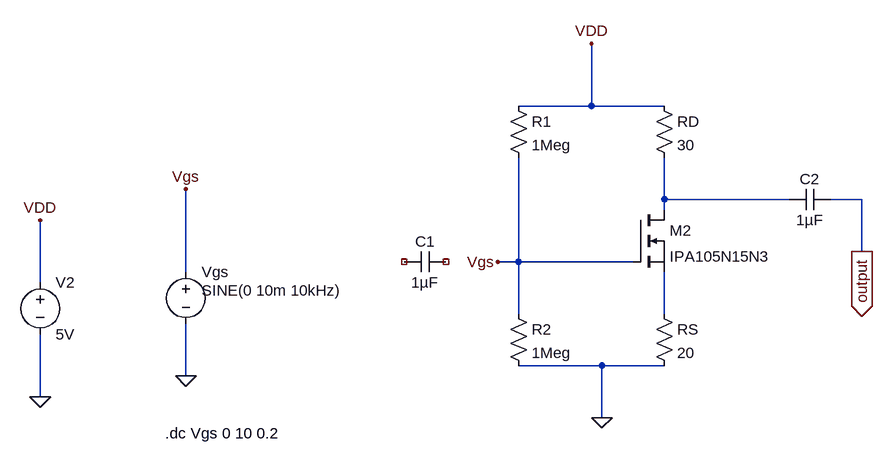
[diagram p0: schematic Draft7.asc]
Draft7.asc, the LTspice schematic file:
Version 4
SHEET 1 880 680
WIRE 128 -48 128 -144
WIRE 128 -48 16 -48
WIRE 240 -48 128 -48
WIRE 240 96 240 32
WIRE 432 96 240 96
WIRE 544 96 496 96
WIRE 240 112 240 96
WIRE 544 176 544 96
WIRE 16 192 16 32
WIRE 16 192 -16 192
WIRE 192 192 16 192
WIRE -496 208 -496 80
WIRE -720 224 -720 128
WIRE 16 272 16 192
WIRE 240 272 240 208
WIRE 144 352 16 352
WIRE 240 352 144 352
WIRE -496 368 -496 288
WIRE -720 400 -720 304
WIRE 144 432 144 352
FLAG 144 432 0
FLAG -496 368 0
FLAG 544 176 output
IOPIN 544 176 Out
FLAG -720 400 0
FLAG -720 128 VDD
FLAG 128 -144 VDD
FLAG -16 192 Vgs
FLAG -496 80 Vgs
SYMBOL res 0 256 R0
SYMATTR InstName R2
SYMATTR Value 1Meg
SYMBOL res 224 256 R0
SYMATTR InstName RS
SYMATTR Value 20
SYMBOL res 224 -64 R0
SYMATTR InstName RD
SYMATTR Value 30
SYMBOL res 0 -64 R0
SYMATTR InstName R1
SYMATTR Value 1Meg
SYMBOL voltage -496 192 R0
WINDOW 123 0 0 Left 0
WINDOW 39 0 0 Left 0
WINDOW 3 24 44 Left 2
SYMATTR Value SINE(0 10m 10kHz)
SYMATTR InstName Vgs
SYMBOL cap -96 176 R90
WINDOW 0 0 32 VBottom 2
WINDOW 3 32 32 VTop 2
SYMATTR InstName C1
SYMATTR Value 1µF
SYMBOL cap 496 80 R90
WINDOW 0 0 32 VBottom 2
WINDOW 3 32 32 VTop 2
SYMATTR InstName C2
SYMATTR Value 1µF
SYMBOL voltage -720 208 R0
WINDOW 123 0 0 Left 0
WINDOW 39 0 0 Left 0
SYMATTR InstName V2
SYMATTR Value 5V
SYMBOL nmos 192 112 R0
SYMATTR InstName M2
SYMATTR Value IPA105N15N3
TEXT -528 456 Left 2 !.dc Vgs 0 10 0.2

The netlist it stands for:
* Draft7.asc
R2 Vgs 0 1Meg
RS N002 0 20
RD VDD N001 30
R1 VDD Vgs 1Meg
Vgs Vgs 0 SINE(0 10m 10kHz)
C1 NC_01 NC_02 1µF
C2 output N001 1µF
V2 VDD 0 5V
M2 N001 Vgs N002 N002 IPA105N15N3
.model NMOS NMOS
.model PMOS PMOS
.lib standard.mos
.dc Vgs 0 10 0.2
.backanno
.end

* Results of the author's LTspice run, read from the files saved beside the schematic
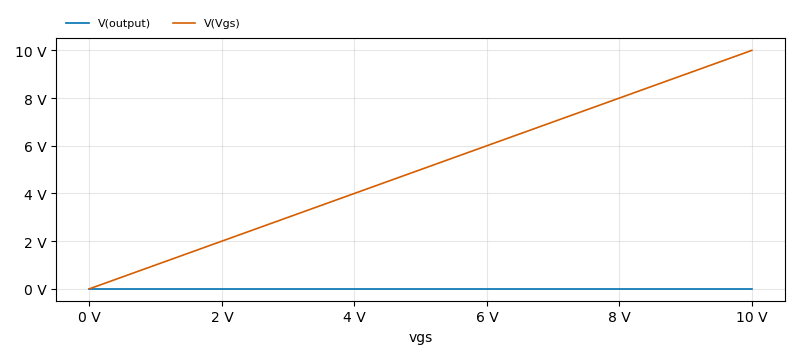
[diagram p1: DC transfer characteristic of Draft7.asc, plotted from the saved traces]
* DC transfer characteristic, 1 run:
*   V(output): 5 µV at vgs=0 V, 2.001 µV at vgs=10 V, min 2.001 µV, max 5 µV
*   V(Vgs): 0 V at vgs=0 V, 10 V at vgs=10 V, min 0 V, max 10 V